# EAGLE design Meeblip V 1.31_SE (EAGLE 5.07)
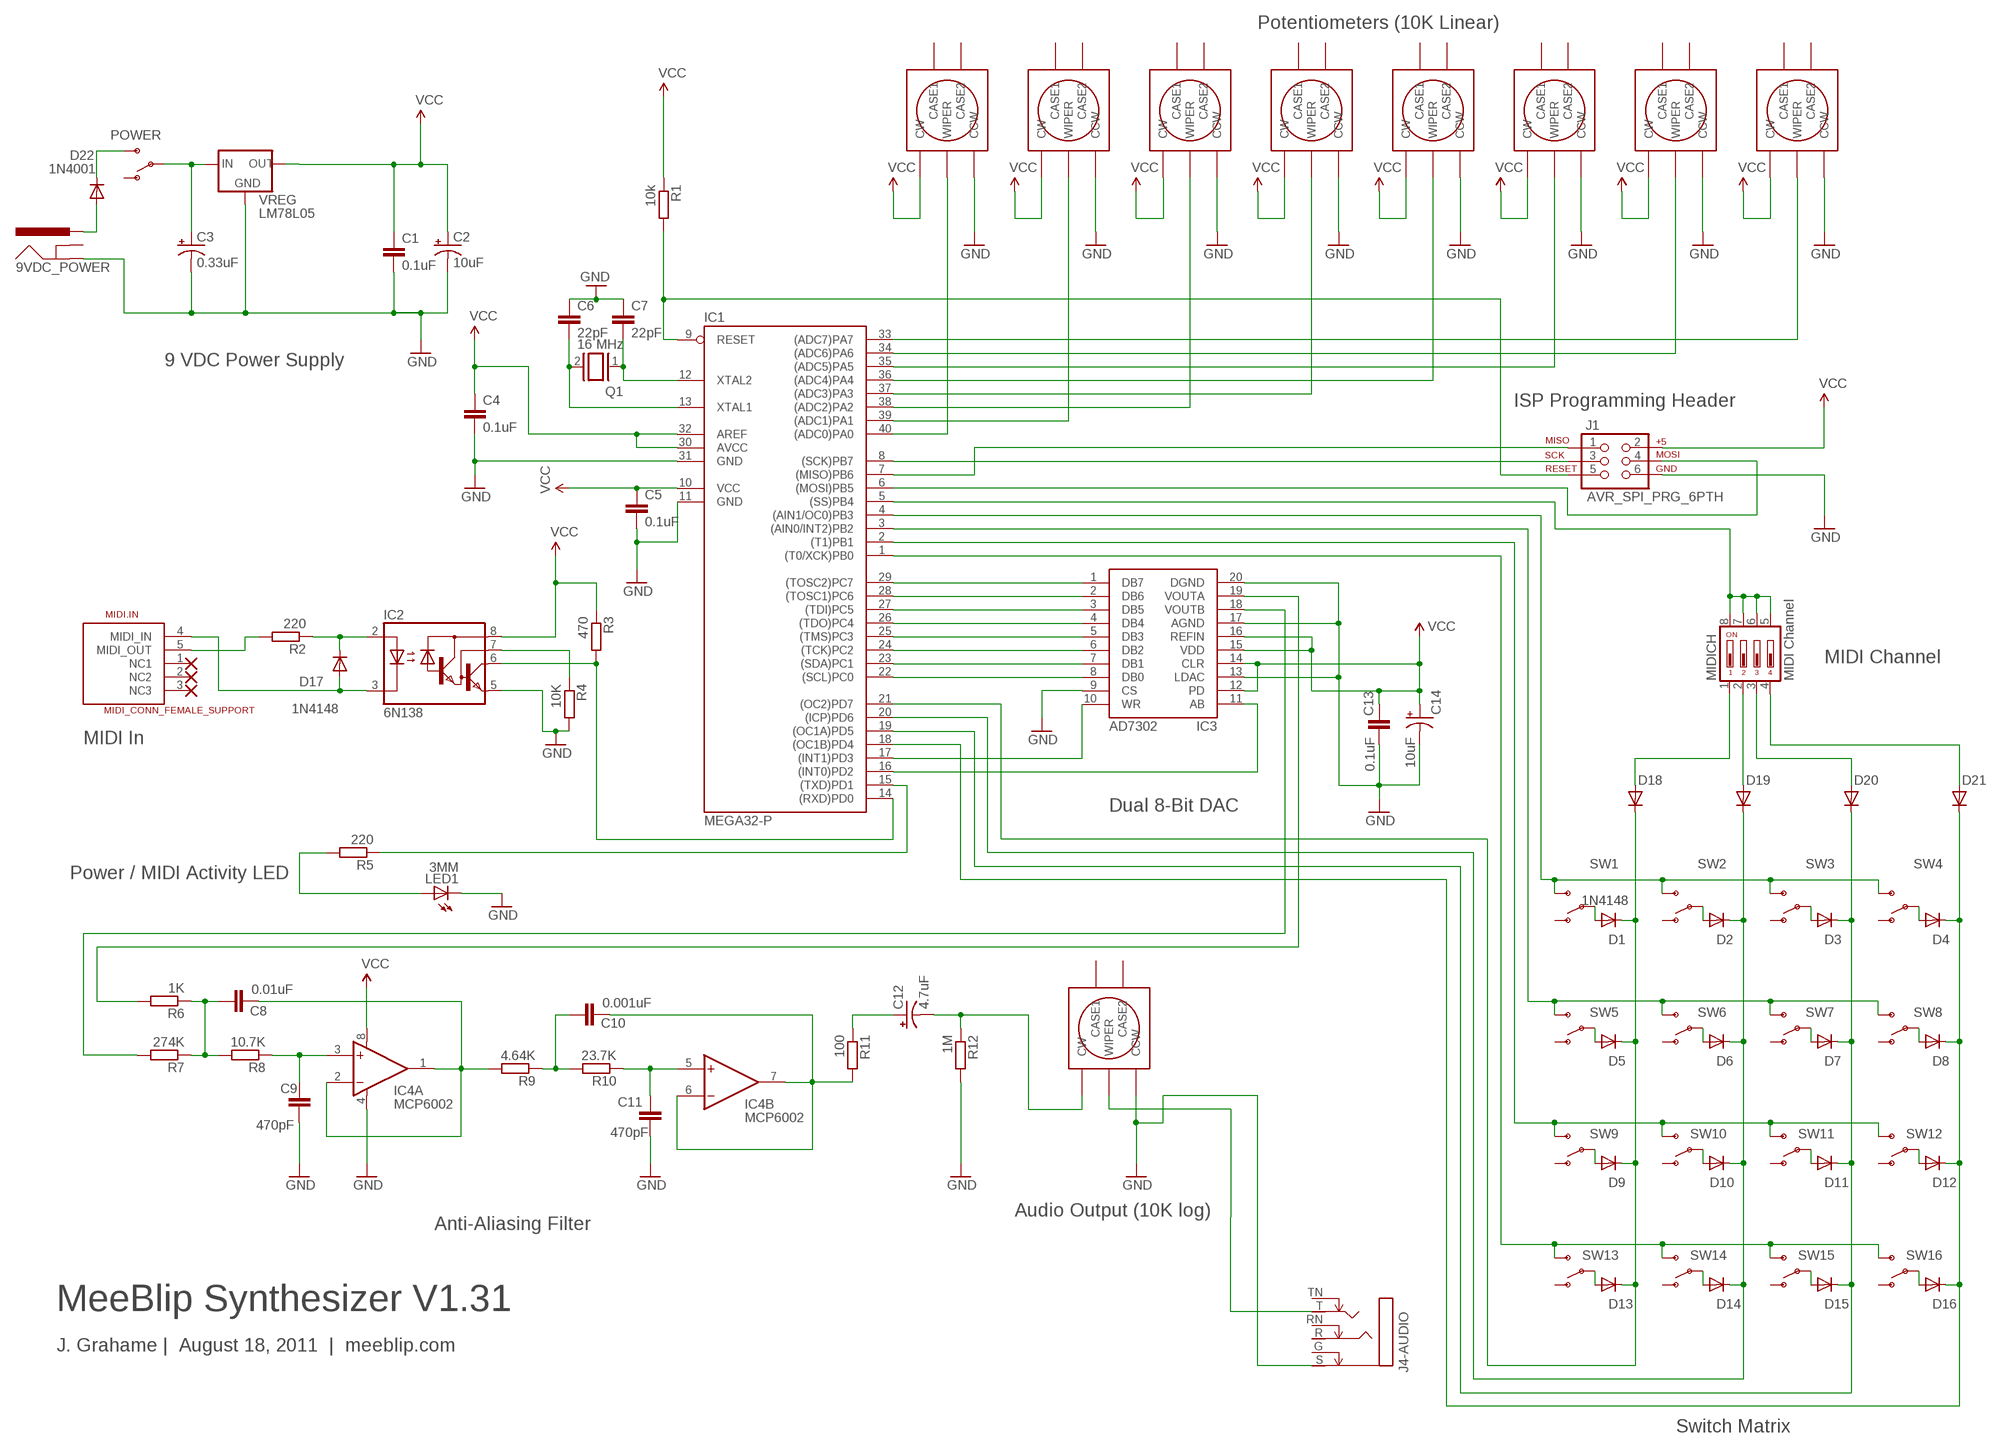
[diagram p0: schematic, sheet 1]

## Parts
9VDC_POWER  POWER_JACKPTH  [POWER_JACK_PTH]
C1  0.1uF  CAPPTH  [CAP-PTH-SMALL]
C2  10uF  CAP_POLPTH2  [CPOL-RADIAL-10UF-25V]
C3  0.33uF  CAP_POLPTH2  [CPOL-RADIAL-10UF-25V]
C4  0.1uF  CAPPTH  [CAP-PTH-SMALL]
C5  0.1uF  CAPPTH  [CAP-PTH-SMALL]
C6  22pF  CAPPTH  [CAP-PTH-SMALL]
C7  22pF  CAPPTH  [CAP-PTH-SMALL]
C8  0.01uF  CAPPTH  [CAP-PTH-SMALL]
C9  470pF  CAPPTH  [CAP-PTH-SMALL]
C10  0.001uF  CAPPTH  [CAP-PTH-SMALL]
C11  470pF  CAPPTH  [CAP-PTH-SMALL]
C12  4.7uF  CAP_POLPTH2  [CPOL-RADIAL-10UF-25V]
C13  0.1uF  CAPPTH  [CAP-PTH-SMALL]
C14  10uF  CAP_POLPTH2  [CPOL-RADIAL-10UF-25V]
D1  1N4148  DIODE1N4148  [DIODE-1N4148]
D2  1N4148  DIODE1N4148  [DIODE-1N4148]
D3  1N4148  DIODE1N4148  [DIODE-1N4148]
D4  1N4148  DIODE1N4148  [DIODE-1N4148]
D5  1N4148  DIODE1N4148  [DIODE-1N4148]
D6  1N4148  DIODE1N4148  [DIODE-1N4148]
D7  1N4148  DIODE1N4148  [DIODE-1N4148]
D8  1N4148  DIODE1N4148  [DIODE-1N4148]
D9  1N4148  DIODE1N4148  [DIODE-1N4148]
D10  1N4148  DIODE1N4148  [DIODE-1N4148]
D11  1N4148  DIODE1N4148  [DIODE-1N4148]
D12  1N4148  DIODE1N4148  [DIODE-1N4148]
D13  1N4148  DIODE1N4148  [DIODE-1N4148]
D14  1N4148  DIODE1N4148  [DIODE-1N4148]
D15  1N4148  DIODE1N4148  [DIODE-1N4148]
D16  1N4148  DIODE1N4148  [DIODE-1N4148]
D17  1N4148  DIODE1N4148  [DIODE-1N4148]
D18  1N4148  DIODE1N4148  [DIODE-1N4148]
D19  1N4148  DIODE1N4148  [DIODE-1N4148]
D20  1N4148  DIODE1N4148  [DIODE-1N4148]
D21  1N4148  DIODE1N4148  [DIODE-1N4148]
D22  1N4001  DIODEPTH  [DIODE-1N4001]
IC1  MEGA32-P  [DIL40]
IC2  6N138  [DIL08]
IC3  AD7302  [DIL20]
IC4  MCP6002  [DIL08]
J1  AVR_SPI_PRG_6PTH  [2X3]
J4-AUDIO  STEREOSWL  [NRJ6HF-1]
LED1  3MM  LED3MM  [LED3MM]
MIDI.IN  MIDI_CONN_FEMALE_SUPPORT  [DIN_5_FEMALE_SUPPORT]
MIDICH  MIDI Channel  DIP04YL  [DIP04YL]
POT0  VACOLOCO_EVUFRK09_POT  [VACOLOCO_EVUF]
POT1  VACOLOCO_EVUFRK09_POT  [VACOLOCO_EVUF]
POT2  VACOLOCO_EVUFRK09_POT  [VACOLOCO_EVUF]
POT3  VACOLOCO_EVUFRK09_POT  [VACOLOCO_EVUF]
POT4  VACOLOCO_EVUFRK09_POT  [VACOLOCO_EVUF]
POT5  VACOLOCO_EVUFRK09_POT  [VACOLOCO_EVUF]
POT6  VACOLOCO_EVUFRK09_POT  [VACOLOCO_EVUF]
POT7  VACOLOCO_EVUFRK09_POT  [VACOLOCO_EVUF]
POWER  SPST  SWITCH-SPSTPTH  [SWITCH-SPDT]
Q1  16 MHz  XTAL/S  [QS]
R1  10k  R-EU_0207/10  [0207/10]
R2  220  R-EU_0207/10  [0207/10]
R3  470  R-EU_0207/10  [0207/10]
R4  10K  R-EU_0207/10  [0207/10]
R5  220  R-EU_0207/10  [0207/10]
R6  1K  R-EU_0207/10  [0207/10]
R7  274K  R-EU_0207/10  [0207/10]
R8  10.7K  R-EU_0207/10  [0207/10]
R9  4.64K  R-EU_0207/10  [0207/10]
R10  23.7K  R-EU_0207/10  [0207/10]
R11  100  R-EU_0207/10  [0207/10]
R12  1M  R-EU_0207/10  [0207/10]
SW1  SPST  SWITCH-SPSTPTH  [SWITCH-SPDT]
SW2  SPST  SWITCH-SPSTPTH  [SWITCH-SPDT]
SW3  SPST  SWITCH-SPSTPTH  [SWITCH-SPDT]
SW4  SPST  SWITCH-SPSTPTH  [SWITCH-SPDT]
SW5  SPST  SWITCH-SPSTPTH  [SWITCH-SPDT]
SW6  SPST  SWITCH-SPSTPTH  [SWITCH-SPDT]
SW7  SPST  SWITCH-SPSTPTH  [SWITCH-SPDT]
SW8  SPST  SWITCH-SPSTPTH  [SWITCH-SPDT]
SW9  SPST  SWITCH-SPSTPTH  [SWITCH-SPDT]
SW10  SPST  SWITCH-SPSTPTH  [SWITCH-SPDT]
SW11  SPST  SWITCH-SPSTPTH  [SWITCH-SPDT]
SW12  SPST  SWITCH-SPSTPTH  [SWITCH-SPDT]
SW13  SPST  SWITCH-SPSTPTH  [SWITCH-SPDT]
SW14  SPST  SWITCH-SPSTPTH  [SWITCH-SPDT]
SW15  SPST  SWITCH-SPSTPTH  [SWITCH-SPDT]
SW16  SPST  SWITCH-SPSTPTH  [SWITCH-SPDT]
VOLUME  Volume  VACOLOCO_EVUFRK09_POT  [VACOLOCO_EVUF]
VREG  LM78L05  78XXL  [78XXL]

## Nets
GND: 9VDC_POWER.GND C1.2 C2.2(-) C3.2(-) C4.2 C5.2 C6.1 C7.1 C9.2 C11.2 C13.2 C14.2(-) IC1.11(GND) IC1.31(GND) IC2.5(GND) IC3.9(CS) IC3.13(LDAC) IC3.17(AGND) IC3.20(DGND) IC4.4(A:V-) J1.6 J4-AUDIO.S LED1.K(C) POT0.CCW POT1.CCW POT2.CCW POT3.CCW POT4.CCW POT5.CCW POT6.CCW POT7.CCW R4.2 R12.2 VOLUME.CCW VREG.GND
N$1: C7.2 IC1.12(XTAL2) Q1.1
N$2: C6.2 IC1.13(XTAL1) Q1.2
N$3: IC1.6((MOSI)PB5) J1.4
N$4: IC1.8((SCK)PB7) J1.3
N$5: IC1.7((MISO)PB6) J1.1
N$6: IC1.40((ADC0)PA0) POT0.WIPER
N$7: IC1.39((ADC1)PA1) POT1.WIPER
N$8: IC1.9(RESET) J1.5 R1.2
N$9: IC1.38((ADC2)PA2) POT2.WIPER
N$10: IC1.37((ADC3)PA3) POT3.WIPER
N$11: IC1.15((TXD)PD1) R5.1
N$12: IC1.36((ADC4)PA4) POT4.WIPER
N$13: LED1.A R5.2
N$14: IC1.35((ADC5)PA5) POT5.WIPER
N$15: IC1.34((ADC6)PA6) POT6.WIPER
N$16: IC1.33((ADC7)PA7) POT7.WIPER
N$17: J4-AUDIO.T VOLUME.WIPER
N$18: D15.A SW15.2(P)
N$19: IC3.19(VOUTA) R6.2
N$20: MIDI.IN.5(MIDI_OUT) R2.2
N$21: C12.1(+) R11.1
N$22: IC1.5((SS)PB4) MIDICH.5 MIDICH.6 MIDICH.7 MIDICH.8
N$23: C12.2(-) R12.1 VOLUME.CW
N$24: D16.A SW16.2(P)
N$25: 9VDC_POWER.PWR D22.A
N$26: IC1.3((AIN0/INT2)PB2) SW5.3(S) SW6.3(S) SW7.3(S) SW8.3(S)
N$27: C3.1(+) POWER.2(P) VREG.IN
N$28: D1.A SW1.2(P)
N$29: D6.A SW6.2(P)
N$30: D1.C D5.C D9.C D13.C D18.C IC1.21((OC2)PD7)
N$31: D3.A SW3.2(P)
N$32: D5.A SW5.2(P)
N$33: D4.C D8.C D12.C D16.C D21.C IC1.18((OC1B)PD4)
N$34: IC1.22((SCL)PC0) IC3.8(DB0)
N$35: IC1.23((SDA)PC1) IC3.7(DB1)
N$36: IC1.24((TCK)PC2) IC3.6(DB2)
N$37: IC1.25((TMS)PC3) IC3.5(DB3)
N$38: IC1.26((TDO)PC4) IC3.4(DB4)
N$39: IC1.27((TDI)PC5) IC3.3(DB5)
N$40: IC1.28((TOSC1)PC6) IC3.2(DB6)
N$41: IC1.29((TOSC2)PC7) IC3.1(DB7)
N$42: D22.C POWER.3(S)
N$43: IC1.17((INT1)PD3) IC3.10(WR)
N$44: D14.A SW14.2(P)
N$45: D17.C IC2.2(A) R2.1
N$46: D17.A IC2.3(C) MIDI.IN.4(MIDI_IN)
N$47: IC1.14((RXD)PD0) IC2.6(VO) R3.2
N$48: IC1.16((INT0)PD2) IC3.11(AB)
N$49: D12.A SW12.2(P)
N$51: D2.A SW2.2(P)
N$52: D7.A SW7.2(P)
N$53: D9.A SW9.2(P)
N$54: D10.A SW10.2(P)
N$55: D11.A SW11.2(P)
N$56: D13.A SW13.2(P)
N$59: D18.A MIDICH.1
N$60: D8.A SW8.2(P)
N$63: D19.A MIDICH.2
N$64: D4.A SW4.2(P)
N$65: D20.A MIDICH.3
N$66: D21.A MIDICH.4
N$69: C8.1 R6.1 R7.1 R8.2
N$70: IC3.18(VOUTB) R7.2
N$71: C9.1 IC4.3(A:+IN) R8.1
N$73: C10.1 R9.1 R10.2
N$74: C11.1 IC4.5(B:+IN) R10.1
N$75: C10.2 IC4.6(B:-IN) IC4.7(B:OUT) R11.2
N$77: C8.2 IC4.1(A:OUT) IC4.2(A:-IN) R9.2
N$96: IC2.7(VB) R4.1
S1: IC1.1((T0/XCK)PB0) SW13.3(S) SW14.3(S) SW15.3(S) SW16.3(S)
S3: IC1.2((T1)PB1) SW9.3(S) SW10.3(S) SW11.3(S) SW12.3(S)
S7: D3.C D7.C D11.C D15.C D20.C IC1.19((OC1A)PD5)
S8: IC1.4((AIN1/OC0)PB3) SW1.3(S) SW2.3(S) SW3.3(S) SW4.3(S)
S10A: D2.C D6.C D10.C D14.C D19.C IC1.20((ICP)PD6)
VCC: C1.1 C2.1(+) C4.1 C5.1 C13.1 C14.1(+) IC1.10(VCC) IC1.30(AVCC) IC1.32(AREF) IC2.8(VCC) IC3.12(PD) IC3.14(CLR) IC3.15(VDD) IC3.16(REFIN) IC4.8(A:V+) J1.2 POT0.CW POT1.CW POT2.CW POT3.CW POT4.CW POT5.CW POT6.CW POT7.CW R1.1 R3.1 VREG.OUT
Unconnected: 9VDC_POWER.GNDBREAK J4-AUDIO.G(SN) J4-AUDIO.R J4-AUDIO.RN J4-AUDIO.TN MIDI.IN.1(NC1) MIDI.IN.2(NC2) MIDI.IN.3(NC3) POT0.CASE1 POT0.CASE2 POT1.CASE1 POT1.CASE2 POT2.CASE1 POT2.CASE2 POT3.CASE1 POT3.CASE2 POT4.CASE1 POT4.CASE2 POT5.CASE1 POT5.CASE2 POT6.CASE1 POT6.CASE2 POT7.CASE1 POT7.CASE2 POWER.1(O) SW1.1(O) SW2.1(O) SW3.1(O) SW4.1(O) SW5.1(O) SW6.1(O) SW7.1(O) SW8.1(O) SW9.1(O) SW10.1(O) SW11.1(O) SW12.1(O) SW13.1(O) SW14.1(O) SW15.1(O) SW16.1(O) VOLUME.CASE1 VOLUME.CASE2

## Notes on the sheet
- Potentiometers (10K Linear)
- 9 VDC Power Supply
- ISP Programming Header
- MIDI Channel
- MIDI In
- Dual 8-Bit DAC
- Power / MIDI Activity LED
- Audio Output (10K log)
- Anti-Aliasing Filter
- MeeBlip Synthesizer V1.31
- J. Grahame |  August 18, 2011  |  meeblip.com
- Switch Matrix

## Library data of the parts
9VDC_POWER = meeblip:POWER_JACK: Power Jack 5.5mm barrel jack for optional 9 VDC power input.
C1 C4-C11 C13 = meeblip:CAP: Capacitor Standard 0.1" leaded capacitor, based on SparkFun library.
C2 C3 C12 C14 = meeblip:CAP_POL: Capacitor Polarized Standard PTH capacitor, from SparkFun.
D1-D20 D22 = meeblip:DIODE: Diodes 1N4148 and 1N4001 power diodes.
D21 = SparkFun:DIODE: Diode These are standard reverse protection diodes and small signal diodes. SMA package can handle up to about 1A. SOD-323 can handle about 200mA. What the SOD-323 package when ordering, there are some mfgs out there that are 5-pin packages.
IC1 = meeblip:MEGA32-P: MICROCONTROLLER 32 Kbytes FLASH 2 Kbytes SRAM 1 Kbytes EEPROM USART 8-channel 10 bit ADC Source: www.atmel.com .. doc2503.pdf
IC2 = meeblip:6N138: MOTOROLA OPTO COUPLER
IC3 = meeblip:AD7302: AD7302
IC4 = meeblip:MCP6002: Dual Op Amp
J1 = meeblip:AVR_SPI_PRG_6: AVR ISP 6 Pin Smaller header for AVR programming. From SparkFun library.
J4-AUDIO = meeblip:STEREOSW: Neutrik Stereo 1/4" Jack Easy to obtain. The mono version is used in MeeBilp, it shares the same pinout.
LED1 = meeblip:LED: LED OSRAM: - CHIPLED LG R971, LG N971, LY N971, LG Q971, LY Q971, LO R971, LY R971 LH N974, LH R974 LS Q976, LO Q976, LY Q976 LO Q996 - Hyper CHIPLED LW Q18S LB Q993, LB Q99A, LB R99A - SideLED LS A670, LO A670, LY A670, LG A670, LP A670 LB A673, LV A673, LT A673, LW A673 LH A674 LY A675 LS A676, LA A676, LO A676, LY A676, LW A676 LS A679, LY A679, LG A679 - Hyper Micro SIDELED® LS Y876, LA Y876, LO Y876, LY Y876 LT Y87S - SmartLED LW L88C, LW L88S LB L89C, LB L89S, LG L890 LS L89K, LO L89K, LY L89K LS L896, LA L896, LO L896, LY L896 - TOPLED LS T670, LO T670, LY T670, LG T670, LP T670 LSG T670, LSP T670, LSY T670, LOP T670, LYG T670 LG T671, LOG T671, LSG T671 LB T673, LV T673, LT T673, LW T673 LH T674 LS T676, LA T676, LO T676, LY T676, LB T676, LH T676, LSB T676, LW T676 LB T67C, LV T67C, LT T67C, LS T67K, LO T67K, LY T67K, LW E67C LS E67B, LA E67B, LO E67B, LY E67B, LB E67C, LV E67C, LT E67C LW T67C LS T679, LY T679, LG T679 LS T770, LO T770, LY T770, LG T770, LP T770 LB T773, LV T773, LT T773, LW T773 LH T774 LS E675, LA E675, LY E675, LS T675 LS T776, LA T776, LO T776, LY T776, LB T776 LHGB T686 LT T68C, LB T68C - Hyper Mini TOPLED® LB M676 - Mini TOPLED Santana® LG M470 LS M47K, LO M47K, LY M47K Source: http://www.osram.convergy.de LUXEON: - LUMILED® LXK2-PW12-R00, LXK2-PW12-S00, LXK2-PW14-U00, LXK2-PW14-V00 LXK2-PM12-R00, LXK2-PM12-S00, LXK2-PM14-U00 LXK2-PE12-Q00, LXK2-PE12-R00, LXK2-PE12-S00, LXK2-PE14-T00, LXK2-PE14-U00 LXK2-PB12-K00, LXK2-PB12-L00, LXK2-PB12-M00, LXK2-PB14-N00, LXK2-PB14-P00, LXK2-PB14-Q00 LXK2-PR12-L00, LXK2-PR12-M00, LXK2-PR14-Q00, LXK2-PR14-R00 LXK2-PD12-Q00, LXK2-PD12-R00, LXK2-PD12-S00 LXK2-PH12-R00, LXK2-PH12-S00 LXK2-PL12-P00, LXK2-PL12-Q00, LXK2-PL12-R00 Source: www.luxeon.com KINGBRIGHT: KA-3528ASYC Source: www.kingbright.com
MIDI.IN = Reflex:MIDI_CONN_FEMALE_SUPPORT
MIDICH = meeblip:DIP04YL: DIL/CODE SWITCH
POT0 POT1-POT7 VOLUME = meeblip:VACOLOCO_EVUF: Panasonic EVUF type potentionmeter Vertical Mount
POWER SW1-SW16 = meeblip:SWITCH-SPST: SPDT Switch ON-ON slide switch. Mouser part #102-1221-EV
Q1 = meeblip:XTAL/S: CRYSTAL Through-hole. Cheap and cheery.
R1-R12 = meeblip:R-EU_: RESISTOR, European symbol
VREG = v-reg:78XXL: VOLTAGE REGULATOR

## Board
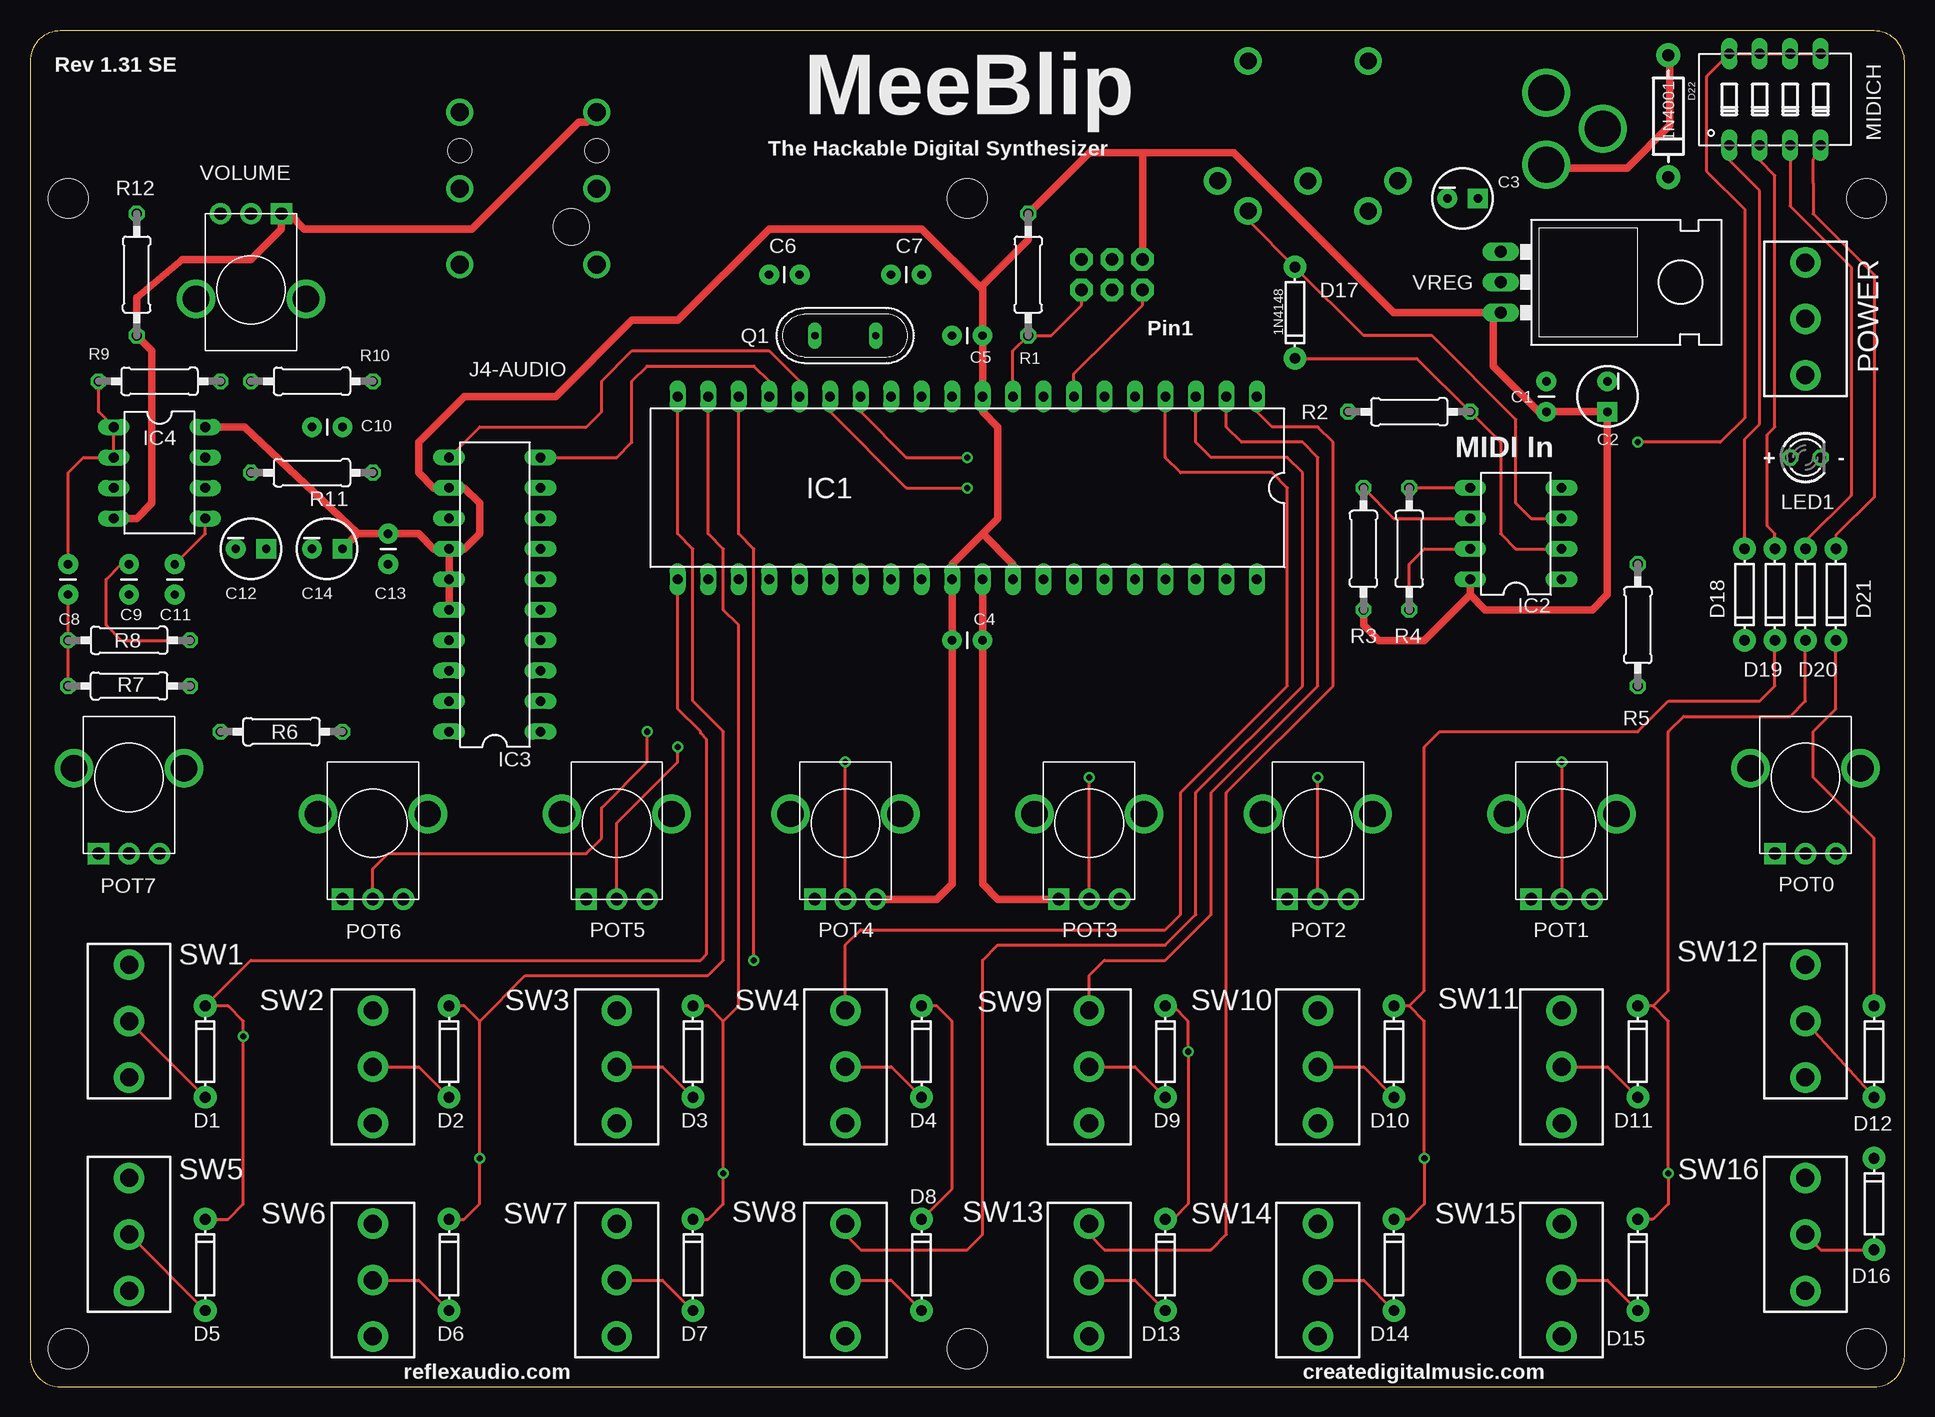
[diagram p1: board, top side]
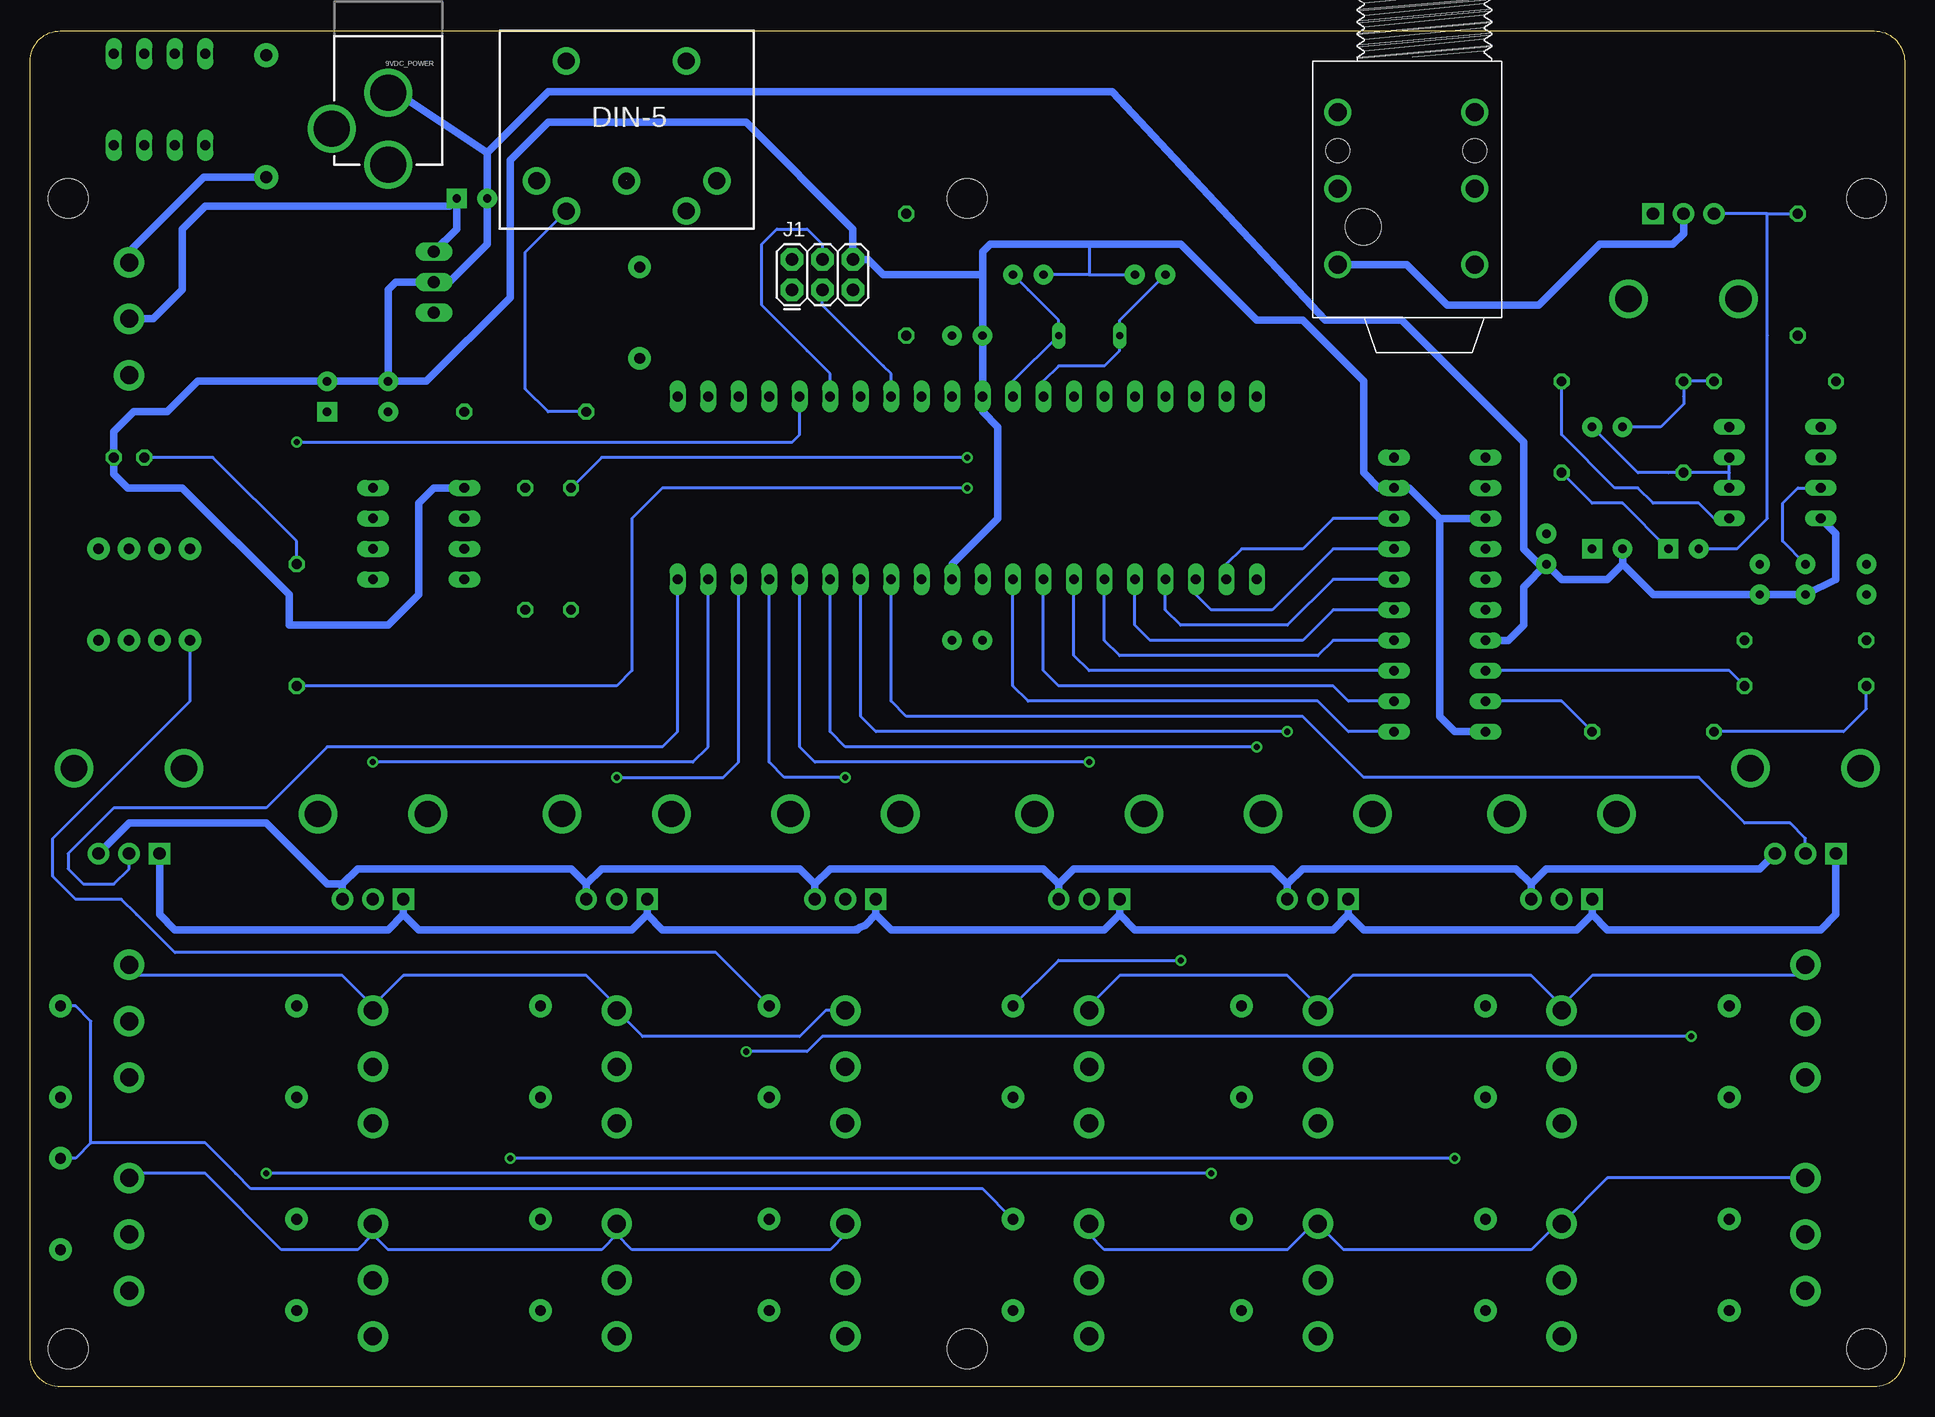
[diagram p2: board, bottom side, seen from below]

Size 156.21 x 113.03 mm. Coordinates in mm from the lower left corner, seen from the top.
Outline: 156.21,110.49 arc90 153.67,113.03 2.54,113.03 arc90 0,110.49 0,2.54 arc90 2.54,0 153.67,0 arc90 156.21,2.54 156.21,110.49
Copper layers (1*16): Top 0.035mm / dielectric 1.5mm / Bottom 0.035mm
Design rules "default": minimum track width 10mil, minimum drill 24mil, track to track 8mil, track to pad 8mil, pad to pad 8mil, via to via 8mil, smd to smd 8mil, copper to edge 40mil, drill to drill 8mil, minimum pad ring 10mil, minimum via ring 8mil, stop-mask expansion 4mil, vias tented up to drill 0mil, thermal gap 10mil

### Footprints (pad centres in the part's own frame; a part is rotated, then mirrored left to right if it is on the bottom)
POWER_JACK_PTH = drill 2.997 round: GND 0,7.7; GNDBREAK 4.7,10.7; PWR 0,13.7
CAP-PTH-SMALL = drill 0.7 pad 1.651 round: 1 0,0; 2 2.54,0
CPOL-RADIAL-10UF-25V = drill 0.7 pad 1.651 square: 1 1.27,0 | drill 0.7 pad 1.651 round: 2 -1.27,0
DIODE-1N4148 = drill 0.9 pad 1.88 round: A -3.81,0; C 3.81,0
DIODE-1N4001 = drill 1 pad 1.981 round: A -5.08,0; C 5.08,0
DIL40 = drill 0.813 long: 1 -24.13,-7.62; 2 -21.59,-7.62; 3 -19.05,-7.62; 4 -16.51,-7.62; 5 -13.97,-7.62; 6 -11.43,-7.62; 7 -8.89,-7.62; 8 -6.35,-7.62; 9 -3.81,-7.62; 10 -1.27,-7.62; 11 1.27,-7.62; 12 3.81,-7.62; 13 6.35,-7.62; 14 8.89,-7.62; 15 11.43,-7.62; 16 13.97,-7.62; 17 16.51,-7.62; 18 19.05,-7.62; 19 21.59,-7.62; 20 24.13,-7.62; 21 24.13,7.62; 22 21.59,7.62; 23 19.05,7.62; 24 16.51,7.62; 25 13.97,7.62; 26 11.43,7.62; 27 8.89,7.62; 28 6.35,7.62; 29 3.81,7.62; 30 1.27,7.62; 31 -1.27,7.62; 32 -3.81,7.62; 33 -6.35,7.62; 34 -8.89,7.62; 35 -11.43,7.62; 36 -13.97,7.62; 37 -16.51,7.62; 38 -19.05,7.62; 39 -21.59,7.62; 40 -24.13,7.62
DIL08 = drill 0.813 long: 1 -3.81,-3.81; 2 -1.27,-3.81; 3 1.27,-3.81; 4 3.81,-3.81; 5 3.81,3.81; 6 1.27,3.81; 7 -1.27,3.81; 8 -3.81,3.81
DIL20 = drill 0.813 long: 1 -11.43,-3.81; 2 -8.89,-3.81; 3 -6.35,-3.81; 4 -3.81,-3.81; 5 -1.27,-3.81; 6 1.27,-3.81; 7 3.81,-3.81; 8 6.35,-3.81; 9 8.89,-3.81; 10 11.43,-3.81; 11 11.43,3.81; 12 8.89,3.81; 13 6.35,3.81; 14 3.81,3.81; 15 1.27,3.81; 16 -1.27,3.81; 17 -3.81,3.81; 18 -6.35,3.81; 19 -8.89,3.81; 20 -11.43,3.81
2X3 = drill 1.016 pad 1.88 octagon: 1 0,0; 2 0,2.54; 3 2.54,0; 4 2.54,2.54; 5 5.08,0; 6 5.08,2.54
NRJ6HF-1 = drill 1.5 round: G -4.2,-5.91; R 7.23,0.44; RN -4.2,0.44; S 7.23,-5.91; T 7.23,6.79; TN -4.2,6.79 | hole 2: 7.23,-2.71; -4.2,-2.71 | hole 3: 5.1,3.64
STAND-OFF = hole 3.302: 0,0
LED3MM = drill 0.813 octagon: A -1.27,0; K 1.27,0
DIN_5_FEMALE_SUPPORT = drill 1.4 pad 2.286 round: 1 0.46,3.61; 2 -7.07,3.6; 3 7.94,3.6; 4 -4.53,6.12; 5 5.47,6.13; 6 -4.53,-6.382; 7 5.478,-6.382
DIP04YL = drill 0.813 long: 1 -3.81,-3.81; 2 -1.27,-3.81; 3 1.27,-3.81; 4 3.81,-3.81; 5 3.81,3.81; 6 1.27,3.81; 7 -1.27,3.81; 8 -3.81,3.81
VACOLOCO_EVUF = drill 2.2 round: CASE1 -4.572,7.112; CASE2 4.572,7.112 | drill 1.016 pad 1.778 square: CCW -2.54,0 | drill 1.016 pad 1.778 round: CW 2.54,0; WIPER 0,0
SWITCH-SPDT = drill 1.5 pad 2.54 round: 1 0,4.699; 2 0,0; 3 0,-4.699
QS = drill 0.61 long: 1 -2.54,0; 2 2.54,0
0207/10 = drill 0.813 octagon: 1 -5.08,0; 2 5.08,0
78XXL = drill 1.016 long: GND 0,-3.81; IN -2.54,-3.81; OUT 2.54,-3.81

### Placement (x,y rotation side)
9VDC_POWER  126.36,115.57 180 bottom
C1  126.36,81.28 90 top
C2  131.44,82.55 270 top
C3  119.38,99.06 0 top
C4  76.83,62.23 0 top
C5  79.38,87.63 180 top
C6  64.14,92.71 180 top
C7  71.75,92.71 0 top
C8  3.17,66.04 90 top
C9  8.26,68.58 270 top
C10  23.5,80.01 0 top
C11  12.06,68.58 270 top
C12  18.41,69.85 0 top
C13  29.84,71.12 270 top
C14  24.77,69.85 0 top
D1  14.61,27.94 90 top
D2  34.92,27.94 90 top
D3  55.24,27.94 90 top
D4  74.3,27.94 90 top
D5  14.61,10.16 90 top
D6  34.92,10.16 90 top
D7  55.24,10.16 90 top
D8  74.3,10.16 90 top
D9  94.61,27.94 90 top
D10  113.67,27.94 90 top
D11  133.99,27.94 90 top
D12  153.67,27.94 90 top
D13  94.61,10.16 90 top
D14  113.67,10.16 90 top
D15  133.99,10.16 90 top
D16  153.67,15.24 90 top
D17  105.41,89.54 270 top
D18  142.88,66.04 270 top
D19  145.41,66.04 270 top
D20  147.96,66.04 270 top
D21  150.5,66.04 270 top
D22  136.53,105.92 270 top
IC1  78.11,74.93 180 top
IC2  123.83,71.12 90 top
IC3  38.73,66.04 90 top
IC4  10.79,76.2 270 top
J1  92.71,91.44 0 bottom
J4-AUDIO  40.01,100.33 180 bottom
JP1  STAND-OFF  [STAND-OFF]  153.03,99.06 0 top
JP4  STAND-OFF  [STAND-OFF]  3.17,99.06 0 top
JP7  STAND-OFF  [STAND-OFF]  78.11,3.18 0 top
JP9  STAND-OFF  [STAND-OFF]  3.17,3.18 0 top
JP10  STAND-OFF  [STAND-OFF]  153.03,3.18 0 top
JP12  STAND-OFF  [STAND-OFF]  78.11,99.06 0 top
LED1  147.96,77.47 0 top
MIDI.IN  106.05,104.14 180 bottom
MIDICH  145.41,107.32 0 top
POT0  147.96,44.45 0 top
POT1  127.64,40.64 0 top
POT2  107.31,40.64 0 top
POT3  88.27,40.64 0 top
POT4  67.94,40.64 0 top
POT5  48.9,40.64 0 top
POT6  28.57,40.64 0 top
POT7  8.26,44.45 0 top
POWER  147.96,89.03 180 top
Q1  67.94,87.63 180 top
R1  83.19,92.71 270 top
R2  114.94,81.28 180 top
R3  111.12,69.85 90 top
R4  114.94,69.85 90 top
R5  133.99,63.5 90 top
R6  20.95,54.61 0 top
R7  8.26,58.42 0 top
R8  8.26,62.23 180 top
R9  10.79,83.82 180 top
R10  23.5,83.82 180 top
R11  23.5,76.2 180 top
R12  8.89,92.71 270 top
SW1  8.26,30.48 180 top
SW2  28.57,26.67 180 top
SW3  48.9,26.67 180 top
SW4  67.94,26.67 180 top
SW5  8.26,12.7 180 top
SW6  28.57,8.89 180 top
SW7  48.9,8.89 180 top
SW8  67.94,8.89 180 top
SW9  88.27,26.67 180 top
SW10  107.31,26.67 180 top
SW11  127.64,26.67 180 top
SW12  147.96,30.48 180 top
SW13  88.27,8.89 180 top
SW14  107.31,8.89 180 top
SW15  127.64,8.89 180 top
SW16  147.96,12.7 180 top
VOLUME  18.41,97.79 180 top
VREG  126.36,92.08 270 top

### Tracks (layer width: path | path; a pad name or v marks a point on that pad's centre or on a via)
GND
  Top 0.254: IC2.5 R4.2
  Top 0.61: IC1.31 C4.2 79.38,41.91 80.64,40.64 POT3.CCW | IC4.4 8.89,72.39 10.16,73.66 10.16,86.36 R12.2 8.89,90.81 12.7,93.98 18.41,93.98 20.95,96.52 VOLUME.CCW 21.59,97.79 22.86,96.52 36.83,96.52 45.72,105.41 46.41,105.41 J4-AUDIO.S
  Bottom 0.254: 67.94,92.71 C6.1 | 67.94,92.71 C7.1 | 67.94,95.25 67.94,92.71
  Bottom 0.61: IC1.31 79.38,68.58 75.56,72.39 75.56,80.01 76.83,81.28 IC1.11 C5.2 76.83,92.71 | POT7.CCW 5.71,39.37 6.99,38.1 24.77,38.1 26.04,39.37 | POT0.CCW 145.41,39.37 144.15,38.1 126.36,38.1 125.09,39.37 | 125.09,39.37 POT1.CCW | 125.09,39.37 123.83,38.1 106.05,38.1 104.78,39.37 | 104.78,39.37 POT2.CCW | 104.78,39.37 103.5,38.1 87.26,38.1 87.07,38.29 | 85.72,39.37 86.62,38.47 87.07,38.29 | 87.07,38.29 87.52,38.1 | 85.72,39.37 POT3.CCW | 85.72,39.37 84.45,38.1 66.67,38.1 65.41,39.37 | 65.41,39.37 POT4.CCW | 46.35,39.37 POT5.CCW | 46.35,39.37 47.62,38.1 64.14,38.1 65.41,39.37 | 26.04,39.37 POT6.CCW | 26.04,39.37 27.3,38.1 45.09,38.1 46.35,39.37 | IC3.20 37.47,54.61 38.73,55.88 38.73,60.96 38.73,63.5 38.73,72.39 | 38.73,72.39 41.27,74.93 IC3.9 43.81,74.93 45.09,76.2 45.09,83.82 50.16,88.9 53.98,88.9 60.33,95.25 67.94,95.25 68.58,95.25 76.2,95.25 76.83,94.62 76.83,92.71 | 38.73,72.39 IC3.13 | C1.2 C2.2 142.24,83.82 144.78,81.28 147.57,81.28 149.22,79.63 LED1.K 149.22,76.07 148.08,74.93 143.51,74.93 134.62,66.04 134.62,63.5 133.99,63.5 126.36,63.5 123.83,66.04 123.83,73.66 122.56,74.93 IC2.5 | C13.2 28.57,67.31 24.77,67.31 23.5,68.58 | 23.5,68.58 C14.2 | 23.5,68.58 20.95,66.04 C9.2 | C9.2 C11.2 C9.2 | IC4.4 5.71,71.12 5.71,67.31 C9.2 | C1.2 126.36,88.9 126.36,91.44 125.73,92.08 VREG.GND 121.28,92.08 120.65,92.71 120.02,93.34 118.11,95.25 C3.2 118.11,102.87 | 106.68,105.41 104.78,105.41 | 106.68,105.41 97.79,105.41 96.52,105.41 87.63,96.52 J1.6 86.36,93.98 85.09,92.71 76.83,92.71 | 106.68,105.41 113.03,105.41 116.2,102.23 116.2,90.81 123.19,83.82 C1.2 | C13.2 30.48,68.58 31.75,69.85 31.75,78.74 41.91,88.9 48.26,88.9 66.04,107.95 113.03,107.95 118.11,102.87
  Bottom 0.61: IC3.17 33.02,62.23 31.75,63.5 31.75,66.68 C13.2 | 9VDC_POWER.GND 125.65,107.87 118.11,102.87
N$1
  Bottom 0.254: IC1.12 74.3,83.82 Q1.1 70.48,88.9 73.03,91.44 C7.2
N$2
  Bottom 0.254: IC1.13 71.75,83.82 70.48,85.09 66.67,85.09 65.41,86.36 Q1.2 65.41,88.9 62.87,91.44 C6.2
N$3
  Bottom 0.254: J1.4 90.17,95.25 91.44,96.52 93.98,96.52 95.25,95.25 95.25,90.17 91.44,86.36 89.53,84.46 IC1.6
N$4
  Bottom 0.254: IC1.8 84.45,84.46 85.09,85.09 90.17,90.17 J1.3
N$5
  Top 0.254: J1.1 92.71,90.17 90.17,87.63 87,84.46 IC1.7
N$6
  Bottom 0.254: IC1.40 102.23,54.61 103.5,53.34 131.44,53.34 136.53,48.26 149.22,48.26 153.03,44.45 153.03,43.18 151.76,41.91 149.22,41.91 147.96,43.18 POT0.WIPER
N$7  (via drill 0.51)
  Top 0.254: v127.64,52.07 POT1.WIPER
  Bottom 0.254: IC1.39 99.69,53.34 100.97,52.07 v127.64,52.07
N$8
  Top 0.254: IC1.9 81.92,86.36 R1.2 85.09,87.63 87.63,90.17 J1.5
N$9  (via drill 0.51)
  Top 0.254: POT2.WIPER v107.31,50.8
  Bottom 0.254: v107.31,50.8 98.42,50.8 97.16,52.07 IC1.38
N$10  (via drill 0.51)
  Top 0.254: POT3.WIPER v88.27,50.8
  Bottom 0.254: IC1.37 94.61,52.07 93.34,50.8 v88.27,50.8
N$11  (via drill 0.51)
  Top 0.254: IC1.15 66.67,81.28 73.03,74.93 v78.11,74.93
  Bottom 0.254: R5.1 107.31,58.42 106.05,59.69 106.05,72.39 103.5,74.93 v78.11,74.93
N$12  (via drill 0.51)
  Top 0.254: POT4.WIPER v67.94,52.07
  Bottom 0.254: IC1.36 92.08,53.34 90.81,52.07 v67.94,52.07
N$13
  Bottom 0.254: R5.2 133.99,70.48 140.97,77.47 LED1.A
N$14  (via drill 0.51)
  Top 0.254: v53.98,53.34 53.98,52.07 48.9,46.99 POT5.WIPER
  Bottom 0.254: IC1.35 89.53,54.61 88.27,53.34 v53.98,53.34
N$15  (via drill 0.51)
  Top 0.254: POT6.WIPER 28.57,43.18 29.84,44.45 46.35,44.45 47.62,45.72 47.62,48.26 51.44,52.07 v51.44,54.61
  Bottom 0.254: IC1.34 87,55.88 85.72,54.61 v51.44,54.61
N$16
  Bottom 0.254: IC1.33 84.45,57.15 83.19,55.88 50.16,55.88 45.09,50.8 17.14,50.8 13.34,46.99 9.53,46.99 8.26,45.72 POT7.WIPER
N$17
  Bottom 0.61: J4-AUDIO.T 41.47,93.54 38.1,90.17 30.48,90.17 25.4,95.25 19.3,95.25 18.41,96.14 VOLUME.WIPER
N$18
  Top 0.254: SW15.2 131.44,8.89 D15.A
N$19
  Bottom 0.254: IC3.19 28.57,57.15 R6.2
N$20
  Bottom 0.254: R2.2 113.03,81.28 114.94,83.19 114.94,94.59 MIDI.IN.5
N$21
  Bottom 0.254: C12.1 23.5,73.66 26.04,73.66 R11.1
N$22  (via drill 0.51)
  Top 0.254: MIDICH.8 143.51,111.12 MIDICH.7 | MIDICH.8 MIDICH.7 | MIDICH.7 MIDICH.6 MIDICH.5 | MIDICH.8 139.7,109.22 139.7,101.35 142.88,98.17 142.88,80.77 140.84,78.74 v133.99,78.74
  Bottom 0.254: IC1.5 92.08,79.38 92.71,78.74 v133.99,78.74
N$23
  Bottom 0.254: C12.2 13.97,69.85 11.43,72.39 11.43,87.63 11.43,97.79 | R12.1 10.16,97.79 11.43,97.79 | 11.43,97.79 VOLUME.CW
N$24
  Top 0.254: D16.A 149.22,11.43 SW16.2
N$25
  Top 0.61: 9VDC_POWER.PWR 126.73,101.87 127,101.6 133.1,101.6 136.65,105.16 136.65,110.87 D22.A
N$26
  Top 0.254: 67.94,13.97 SW8.3 67.94,12.7 69.22,11.43 78.11,11.43 79.38,12.7 79.38,35.56 80.64,36.83 94.61,36.83 97.16,39.37 97.16,49.53 106.05,58.42 106.05,76.2 104.78,77.47 98.42,77.47 97.16,78.74 IC1.3
  Bottom 0.254: SW5.3 24.77,17.4 SW6.3 28.96,13.59 31.11,11.43 46.74,11.43 SW7.3 49.28,13.59 51.44,11.43 66.67,11.43 67.94,12.7 SW8.3
N$27
  Bottom 0.61: POWER.2 147.19,89.03 145.92,89.03 143.51,91.44 143.51,96.52 141.6,98.43 121.28,98.43 C3.1 120.65,96.52 VREG.IN
N$28
  Top 0.254: D1.A SW1.2
N$29
  Top 0.254: SW6.2 32.38,8.89 D6.A
N$30  (via drill 0.51)
  Top 0.254: IC1.21 53.98,56.52 55.88,54.61 55.88,54.48 56.39,53.98 56.39,36.07 55.88,35.56 18.41,35.56 D1.C 16.51,31.75 17.78,30.48 v17.78,29.21 17.78,15.24 16.51,13.97 D5.C | D9.C 95.25,31.75 96.52,30.48 v96.52,27.94 96.52,15.24 95.25,13.97 D13.C
  Bottom 0.254: v96.52,27.94 91.44,27.94 90.17,29.21 v17.78,29.21 | D18.C 142.88,57.15 154.31,45.72 154.31,42.55 152.4,40.64 148.59,40.64 147.32,39.37 144.15,36.2 99.06,36.2 D9.C
N$31
  Top 0.254: SW3.2 52.7,26.67 D3.A
N$32
  Top 0.254: D5.A SW5.2
N$33  (via drill 0.51)
  Top 0.254: D4.C 75.56,31.75 76.83,30.48 76.83,16.51 D8.C | IC1.18 59.05,71.12 60.33,69.85 v60.33,35.56 | D21.C 150.5,56.52 148.59,54.61 148.59,50.8 153.67,45.72 D12.C
  Bottom 0.254: D8.C 76.83,16.51 137.79,16.51 139.06,17.78 141.6,20.32 151.13,20.32 | v60.33,35.56 70.48,35.56 D4.C | D12.C 152.4,31.75 151.13,30.48 151.13,20.32 | D16.C 152.4,19.05 151.13,20.32
N$34
  Bottom 0.254: IC1.22 56.52,68.58 55.24,69.85 50.16,69.85 47.62,72.39 IC3.8
N$35
  Bottom 0.254: IC1.23 59.05,66.04 57.78,64.77 52.7,64.77 47.62,69.85 IC3.7
N$36
  Bottom 0.254: IC1.24 61.59,64.77 60.33,63.5 51.44,63.5 47.62,67.31 IC3.6
N$37
  Bottom 0.254: IC1.25 64.14,63.5 62.87,62.23 50.16,62.23 47.62,64.77 IC3.5
N$38
  Bottom 0.254: IC1.26 66.67,62.23 65.41,60.96 48.9,60.96 47.62,62.23 IC3.4
N$39
  Bottom 0.254: IC1.27 69.22,60.96 67.94,59.69 IC3.3
N$40
  Bottom 0.254: IC1.28 71.75,59.69 70.48,58.42 47.62,58.42 46.35,57.15 IC3.2
N$41
  Bottom 0.254: IC1.29 74.3,58.42 73.03,57.15 48.9,57.15 46.35,54.61 IC3.1
N$42
  Bottom 0.61: D22.C 141.73,100.84 147.96,94.62 POWER.3
N$43
  Top 0.254: IC1.17 61.59,83.82 60.33,85.09 51.44,85.09 50.16,83.82 50.16,78.74 48.9,77.47 IC3.10
N$44
  Top 0.254: SW14.2 111.12,8.89 D14.A
N$45
  Top 0.254: IC2.2 123.83,69.85 122.56,71.12 122.56,78.74 R2.1 115.57,85.73 D17.C
N$46
  Top 0.254: IC2.3 126.36,72.39 125.09,72.39 123.83,73.66 123.83,80.01 123.83,80.65 116.84,87.63 111.12,87.63 D17.A 101.6,97.16 101.6,97.94 MIDI.IN.4
N$47  (via drill 0.51)
  Top 0.254: IC2.6 113.67,72.39 R3.2 | v78.11,77.47 73.03,77.47 69.22,81.28 IC1.14
  Bottom 0.254: v78.11,77.47 108.58,77.47 R3.2
N$48
  Top 0.254: IC1.16 64.14,83.82 61.59,86.36 50.16,86.36 47.62,83.82 47.62,81.28 46.35,80.01 37.47,80.01 IC3.11
N$49
  Top 0.254: D12.A SW12.2
N$51
  Top 0.254: SW2.2 32.38,26.67 D2.A
N$52
  Top 0.254: SW7.2 52.7,8.89 D7.A
N$53
  Top 0.254: SW9.2 92.08,26.67 D9.A
N$54
  Top 0.254: SW10.2 111.12,26.67 D10.A
N$55
  Top 0.254: SW11.2 131.44,26.67 D11.A
N$56
  Top 0.254: D13.A 92.08,8.89 SW13.2
N$59
  Top 0.254: D18.A 142.88,78.99 144.15,80.26 144.15,99.7 141.6,102.23 MIDICH.1
N$60
  Top 0.254: SW8.2 71.75,8.89 D8.A
N$63
  Top 0.254: D19.A 145.41,71.12 144.78,71.76 144.78,79.38 145.41,80.01 145.41,100.97 144.15,102.23 MIDICH.2
N$64
  Top 0.254: SW4.2 71.75,26.67 D4.A
N$65
  Top 0.254: MIDICH.3 146.69,98.43 151.76,93.34 151.76,74.3 147.96,70.48 D20.A
N$66
  Top 0.254: MIDICH.4 148.59,102.23 148.59,100.33 148.59,97.79 153.67,92.71 153.67,74.17 150.5,70.99 D21.A
N$69
  Top 0.254: R7.1 R8.2 C8.1
  Bottom 0.254: R7.1 3.17,56.52 5.08,54.61 R6.1
N$70
  Bottom 0.254: IC3.18 14.61,59.69 R7.2
N$71
  Top 0.254: R8.1 7.62,62.23 6.35,63.5 6.35,67.31 7.62,68.58 C9.1
  Bottom 0.254: IC4.3 8.89,74.93 10.16,73.66 10.16,71.12 10.16,70.48 C9.1
N$73
  Bottom 0.254: R9.1 R10.2 18.41,82.55 18.41,81.92 20.32,80.01 C10.1
N$74
  Top 0.254: IC4.5 14.61,71.12 C11.1
  Bottom 0.254: IC4.5 15.88,72.39 17.14,73.66 20.95,73.66 22.23,74.93 24.13,74.93 28.57,79.38 R10.1
N$75
  Bottom 0.254: IC4.6 14.61,76.2 | 14.61,76.2 IC4.7 | 14.61,76.2 R11.2 | R11.2 19.68,76.2 | C10.2 26,79.97 22.23,76.2 R11.2
N$77
  Top 0.254: R9.2 5.71,81.28 IC4.1 IC4.2 5.71,77.47 4.45,77.47 3.17,76.2 C8.2
N$96
  Top 0.254: IC2.7 116.2,69.85 114.94,68.58 R4.1
S1
  Top 0.254: 89.53,11.43 98.42,11.43 99.69,12.7 99.69,49.53 108.58,58.42 108.58,78.74 107.31,80.01 103.5,80.01 102.23,81.28 IC1.1 | 88.27,12.7 89.53,11.43 | 88.27,12.7 89.53,11.43 | SW13.3 88.27,12.7
  Bottom 0.254: 107.31,12.7 106.05,11.43 89.53,11.43 88.27,12.7 SW13.3 | 107.31,12.7 SW14.3 | 107.31,12.7 108.58,11.43 126.36,11.43 127.64,12.7 | 127.64,12.7 SW15.3 | 127.64,12.7 128.91,11.43 135.25,11.43 141.6,17.78 147.57,17.78 SW16.3
S3
  Top 0.254: SW9.3 88.27,34.29 89.53,35.56 94.61,35.56 98.42,39.37 98.42,49.53 107.31,58.42 107.31,77.47 106.05,78.74 100.97,78.74 99.69,80.01 IC1.2
  Bottom 0.254: SW9.3 89.92,31.37 92.08,29.21 105.16,29.21 SW10.3 107.31,31.75 109.86,34.29 125.09,34.29 127.64,31.75 | 127.64,31.75 SW11.3 | 127.64,31.75 130.18,34.29 147.57,34.29 SW12.3
S7  (via drill 0.51)
  Top 0.254: 135.25,31.75 136.53,30.48 v136.53,17.78 136.53,15.24 135.25,13.97 D15.C | 135.25,31.75 D11.C | 57.78,30.48 56.52,31.75 D3.C | D7.C 56.52,13.97 57.78,15.24 v57.78,17.78 57.78,30.48 | IC1.19 56.52,71.12 57.78,69.85 57.78,64.77 59.05,63.5 59.05,31.75 57.78,30.48 | D20.C 147.96,57.15 146.69,55.88 137.79,55.88 136.53,54.61 136.53,33.02 135.25,31.75
  Bottom 0.254: v57.78,17.78 v136.53,17.78
S8
  Top 0.254: IC1.4 94.61,77.47 95.89,76.2 103.5,76.2 104.78,74.93 104.78,58.42 95.89,49.53 95.89,39.37 94.61,38.1 69.22,38.1 67.94,36.83 SW4.3
  Bottom 0.254: 28.57,31.75 31.11,34.29 45.97,34.29 SW3.3 48.9,31.75 51.44,34.29 65.41,34.29 67.94,31.75 SW4.3 | 28.57,31.75 SW2.3 | 28.57,31.75 26.04,34.29 8.64,34.29 SW1.3
S10A  (via drill 0.51)
  Top 0.254: 114.94,31.75 116.2,30.48 v116.2,19.05 116.2,15.24 114.94,13.97 D14.C | 114.94,31.75 D10.C | 37.47,30.48 36.2,31.75 D2.C | D6.C 36.2,13.97 37.47,15.24 v37.47,19.05 37.47,30.48 | IC1.20 53.98,71.12 55.24,69.85 55.24,57.15 57.78,54.61 57.78,35.56 56.52,34.29 41.27,34.29 37.47,30.48 | D19.C 145.41,58.42 144.15,57.15 136.53,57.15 133.99,54.61 117.47,54.61 116.2,53.34 116.2,33.02 114.94,31.75
  Bottom 0.254: v37.47,19.05 v116.2,19.05
VCC
  Top 0.61: 79.38,71.12 76.83,68.58 IC1.30 C4.1 76.83,41.91 75.56,40.64 POT4.CW | IC1.32 81.92,68.58 79.38,71.12 | 33.66,74.93 IC3.12 36.2,74.93 | 32.38,76.2 33.66,74.93 | 32.38,78.74 32.38,76.2 | 36.2,74.93 37.47,73.66 | 37.47,73.66 37.47,71.12 | 37.47,71.12 36.2,69.85 IC3.14 | IC3.14 IC3.15 IC3.16 34.92,68.58 | R3.1 111.12,63.5 112.39,62.23 116.2,62.23 120.02,66.04 | 79.38,71.12 80.64,72.39 80.64,80.01 79.38,81.28 IC1.10 C5.1 79.38,91.44 | 79.38,91.44 74.3,96.52 61.59,96.52 53.98,88.9 50.16,88.9 43.81,82.55 36.2,82.55 32.38,78.74 | IC3.14 33.66,69.85 32.38,71.12 C13.1 27.3,71.12 | IC4.8 17.91,80.01 27.3,71.12 | 27.3,71.12 C14.1 | 120.02,66.04 IC2.8 | 120.02,66.04 121.28,64.77 130.18,64.77 131.44,66.04 C2.1 C1.1 125.73,81.28 121.92,85.09 121.92,88.9 VREG.OUT 113.67,89.54 113.03,90.17 100.33,102.87 92.71,102.87 | 37.47,73.66 37.47,71.12 | 36.2,74.93 37.47,73.66 | 33.66,74.93 36.2,74.93 | 32.38,76.2 33.66,74.93 | 32.38,78.74 32.38,76.2 | 79.38,91.44 79.38,91.82 83.19,95.63 R1.1 88.27,102.87 90.17,102.87 91.44,102.87 92.71,102.87 | J1.2 92.71,97.79 92.71,100.33 92.71,102.87
  Bottom 0.61: 90.81,41.91 92.08,43.18 108.58,43.18 109.86,41.91 | 109.86,41.91 POT2.CW | 109.86,41.91 111.12,43.18 128.91,43.18 130.18,41.91 | 130.18,41.91 POT1.CW | 90.81,41.91 POT3.CW | 90.81,41.91 89.53,43.18 71.75,43.18 70.48,41.91 | 70.48,41.91 POT4.CW | 70.48,41.91 69.22,43.18 52.7,43.18 51.44,41.91 | 51.44,41.91 POT5.CW | 51.44,41.91 50.16,43.18 32.38,43.18 31.11,41.91 | 31.11,41.91 POT6.CW | 31.11,41.91 29.84,43.18 12.06,43.18 POT7.CW | 130.18,41.91 131.44,41.91 136.53,46.99 147.96,46.99 POT0.CW

### Text on the board
tPlace: MIDI In | reflexaudio.com | createdigitalmusic.com
tNames: Rev 1.31 SE | MeeBlip | The Hackable Digital Synthesizer | Pin1 | + | -